# Altium schematic sheet Schematic.SchDoc (part 1 of 2)
size D; SheetNumber: 1; SheetTotal: 2
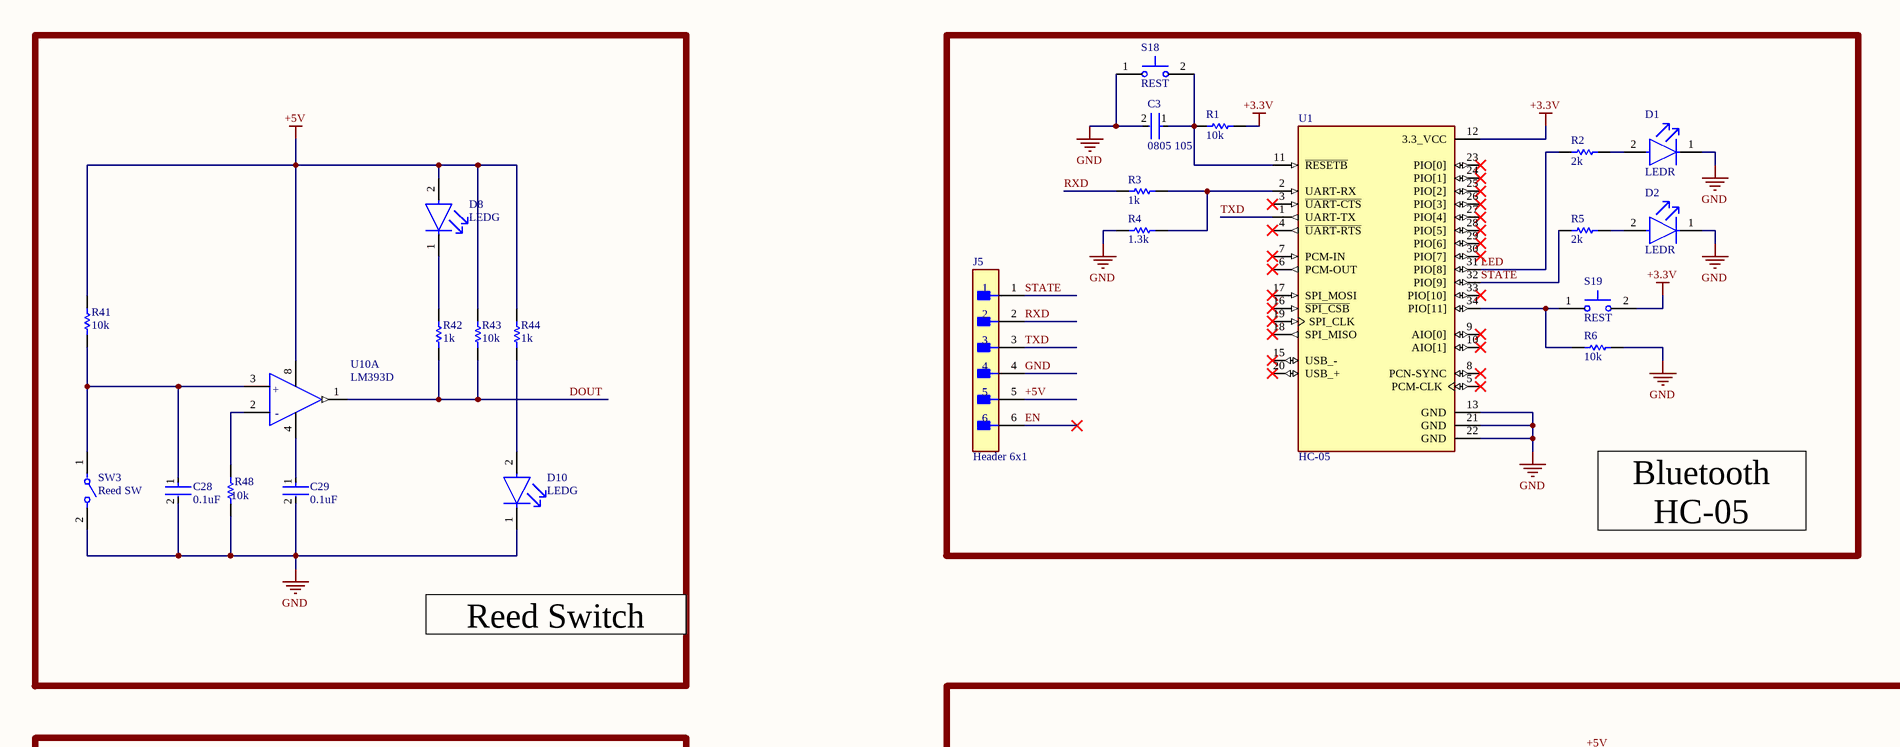
[diagram p0: Schematic.SchDoc, top left]
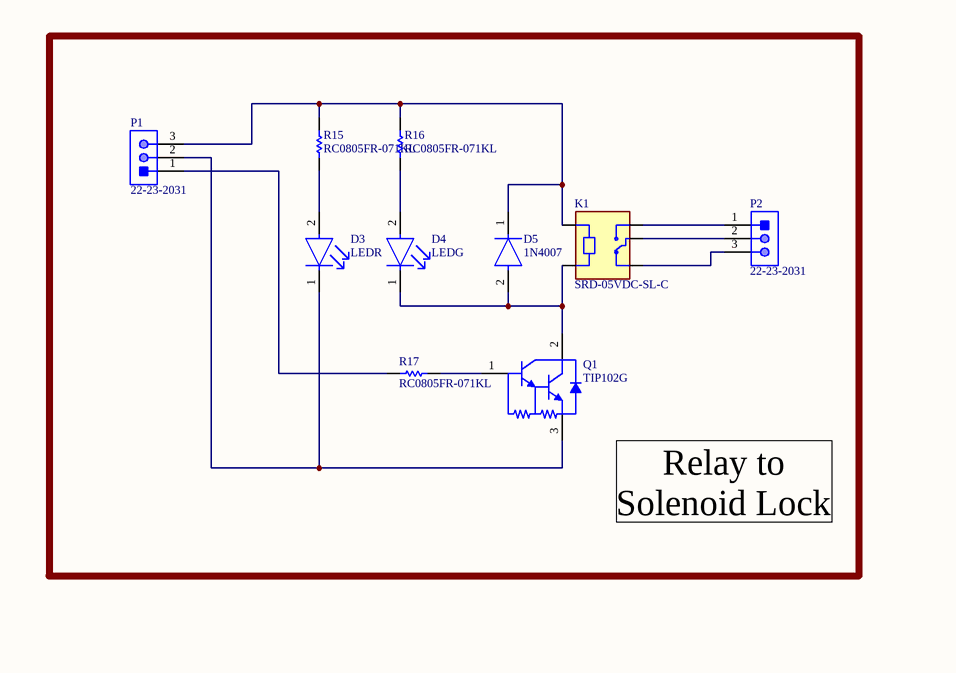
[diagram p1: Schematic.SchDoc, top right]
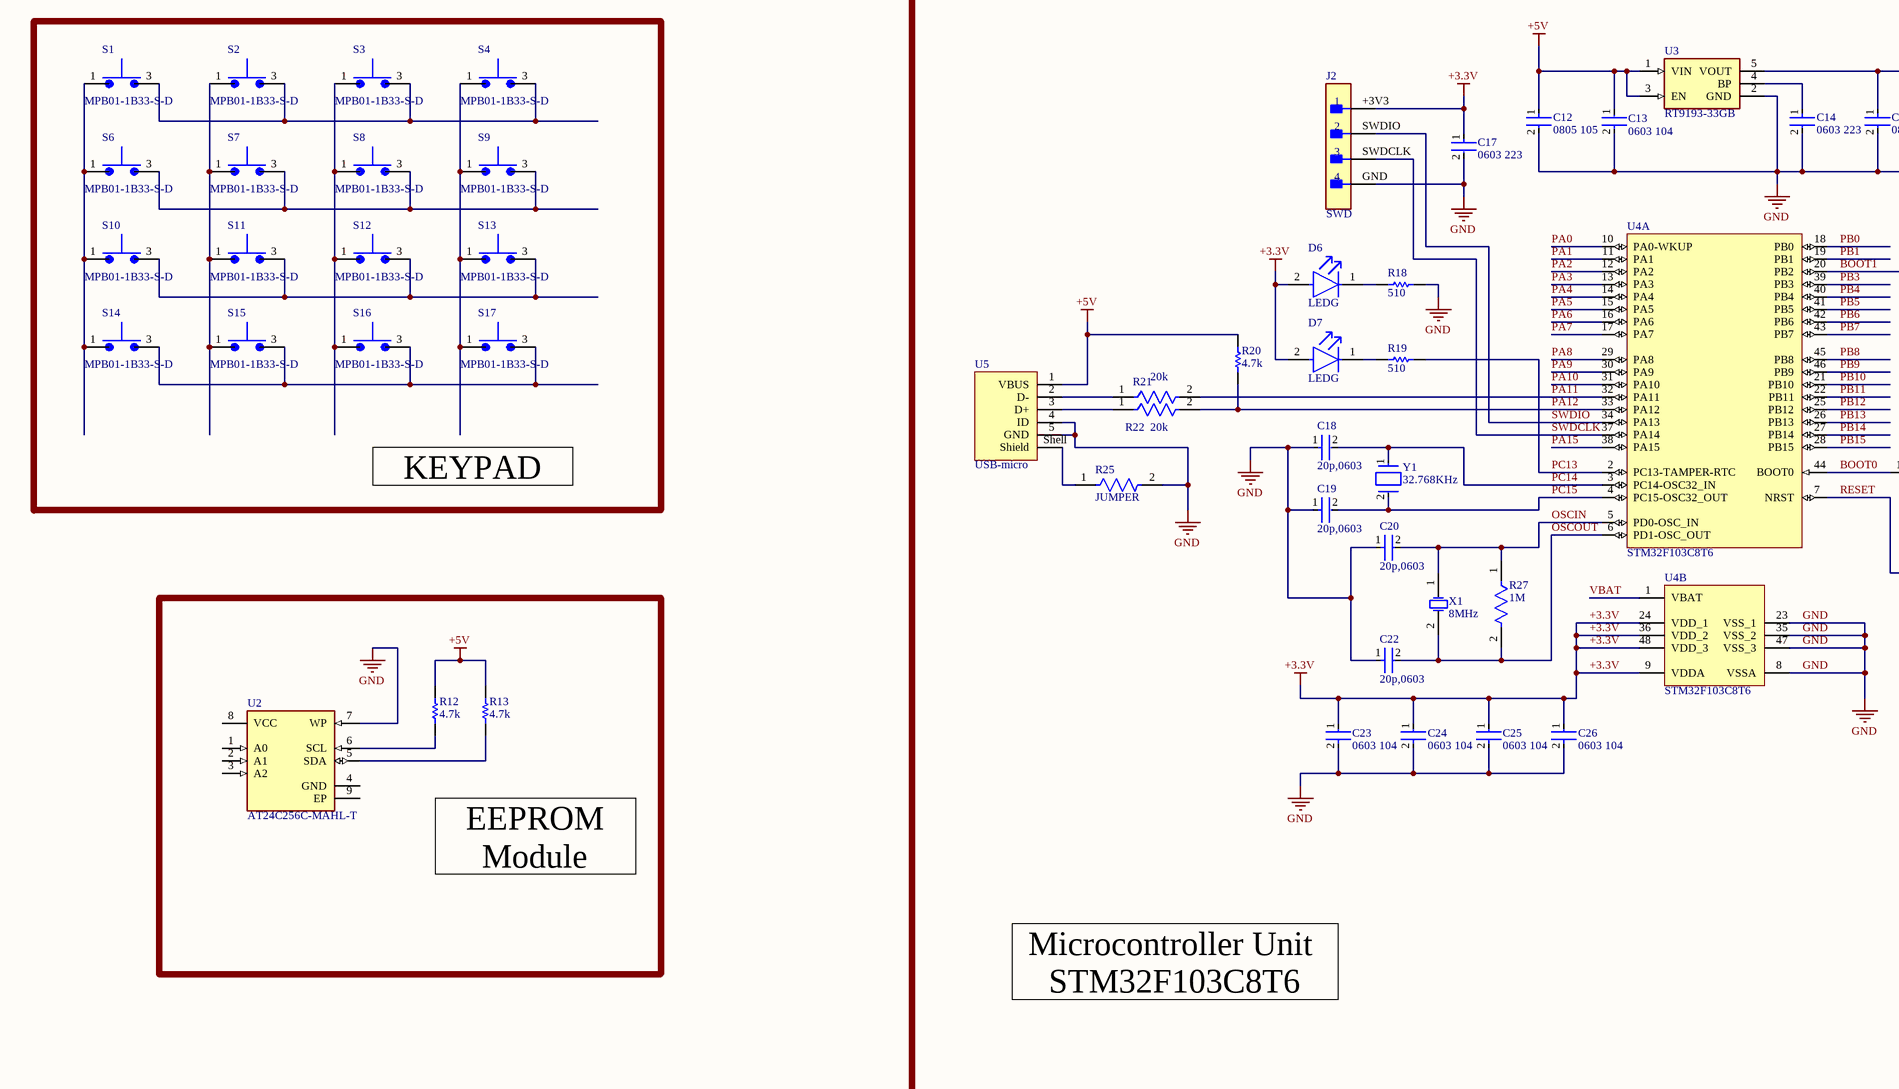
[diagram p2: Schematic.SchDoc, bottom left]
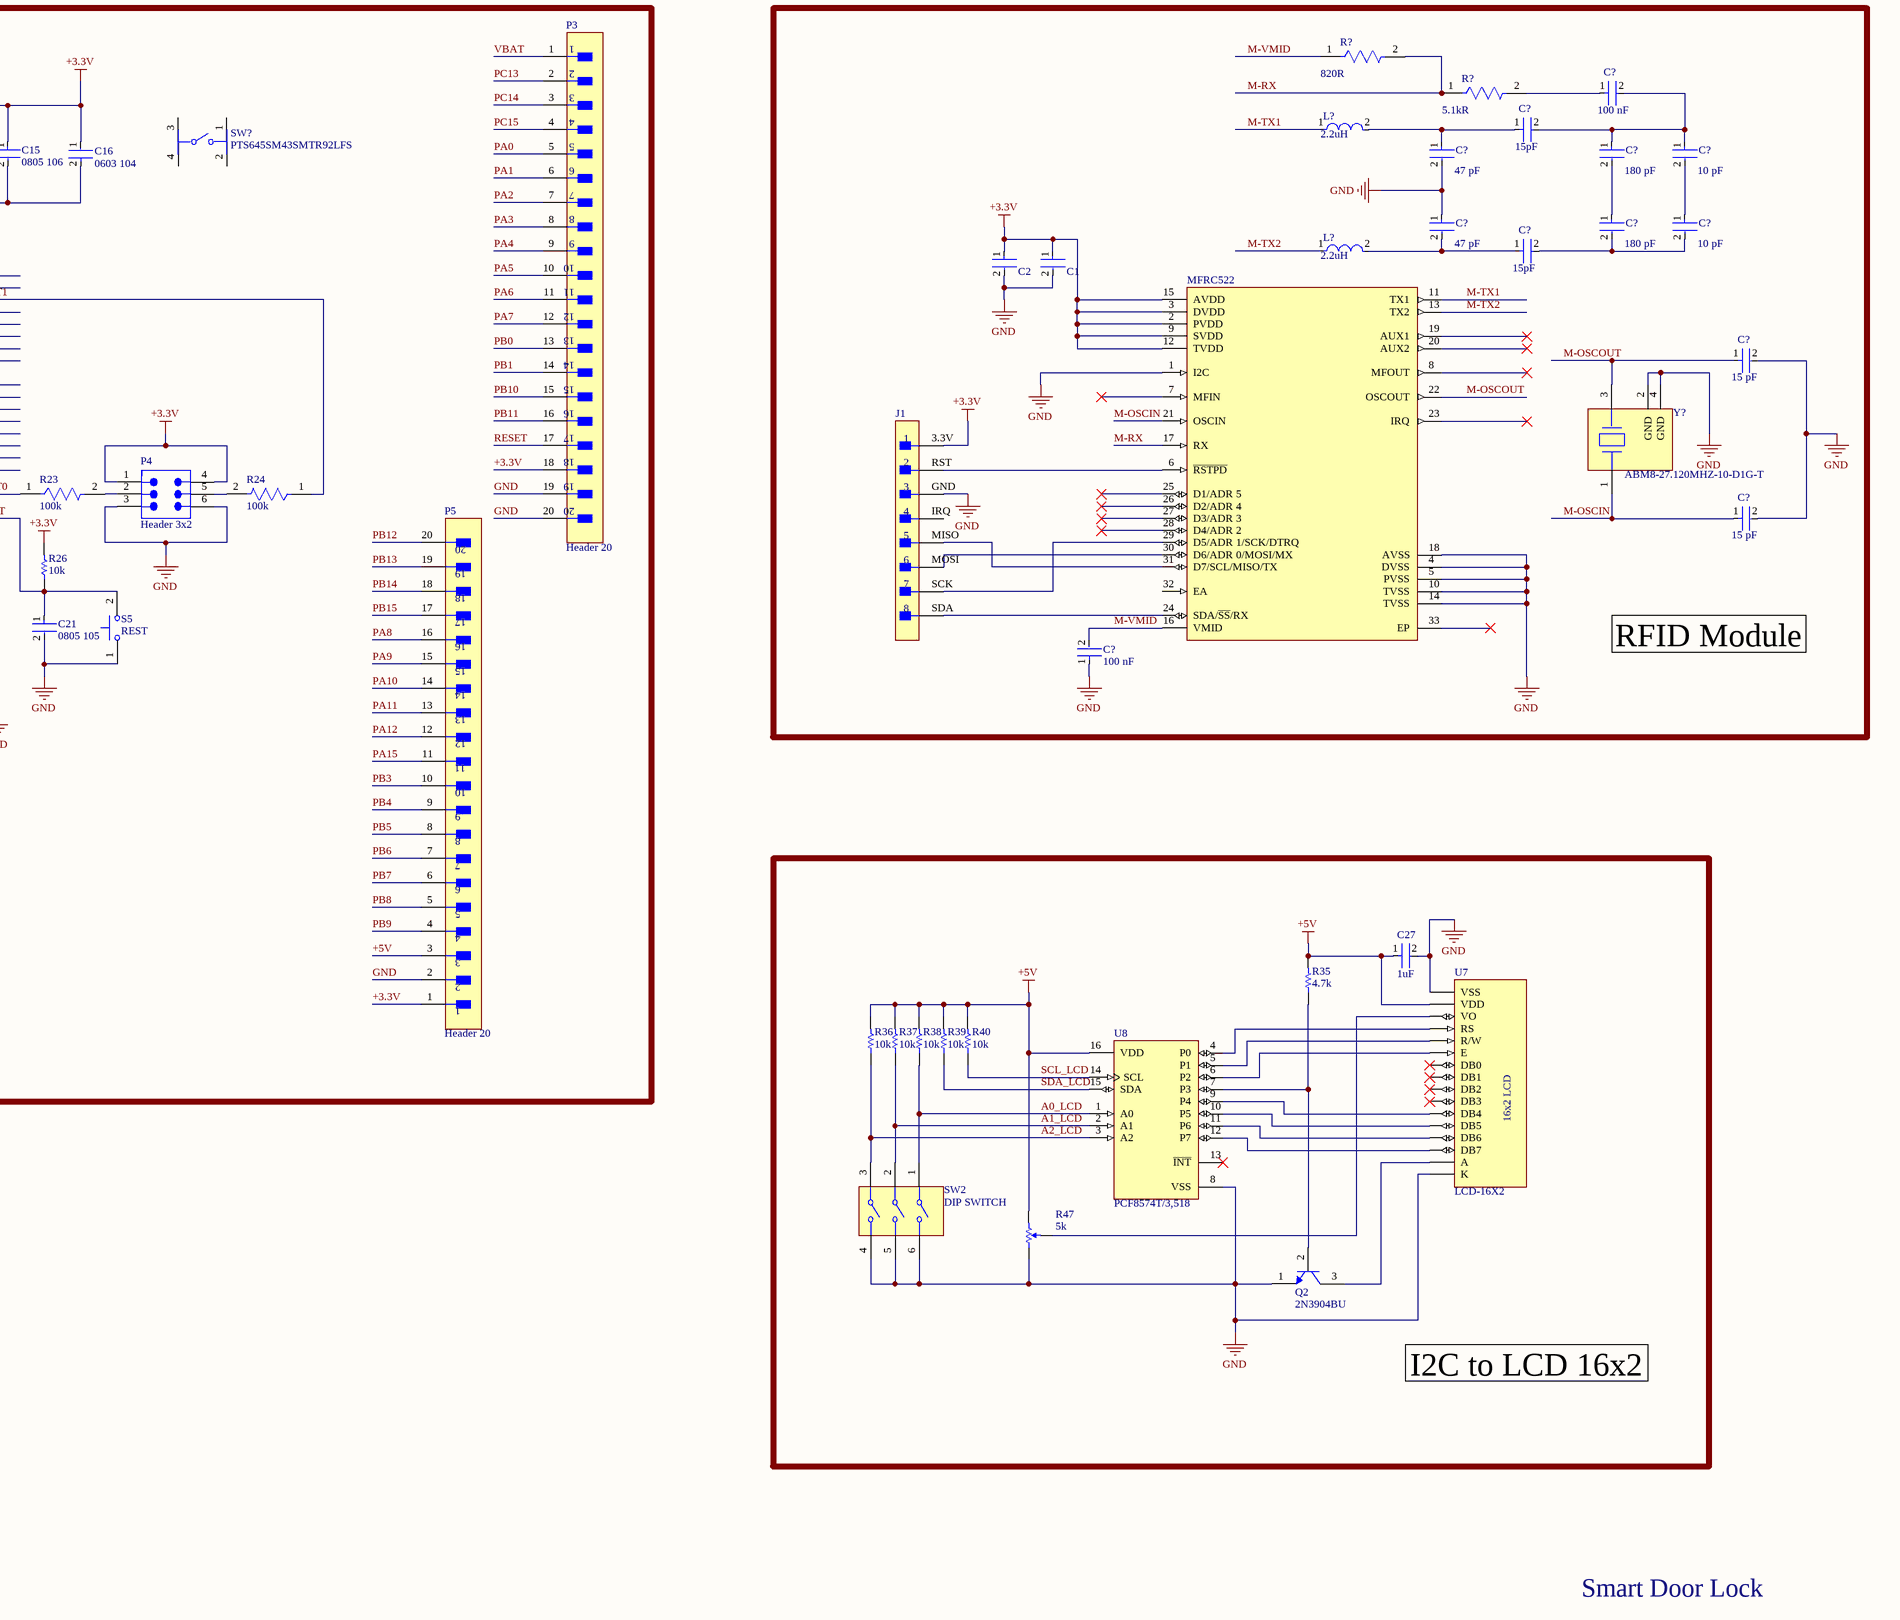
[diagram p3: Schematic.SchDoc, bottom right]

## Parts
(Parts that share a designator on the sheet are numbered #1, #2 ... from top to bottom, then left to right.)
C1  CC0805KKX7R8BB105  [FP-CC0805-0_85-MFG]  (value not drawn)
C2  CC0805KKX7R8BB105  [FP-CC0805-0_85-MFG]  (value not drawn)
C3  0805 105  [FP-CC0805-0_85-MFG]
C12  0805 105  [FP-CC0805-0_85-MFG]
C13  0603 104  [FP-C1608-080-0_1-IPC_C]
C14  0603 223  [FP-CC0603-DA-MFG]
C15  0805 106  [FP-0805-L_2_01_0_2-W_1_25-MFG]
C16  0603 104  [FP-C1608-080-0_1-IPC_C]
C17  0603 223  [FP-CC0603-DA-MFG]
C18  20p,0603  [FP-C0603C-CF-MFG]
C19  20p,0603  [FP-C0603C-CF-MFG]
C20  20p,0603  [FP-C0603C-CF-MFG]
C21  0805 105  [FP-CC0805-0_85-MFG]
C22  20p,0603  [FP-C0603C-CF-MFG]
C23  0603 104  [FP-C1608-080-0_1-IPC_C]
C24  0603 104  [FP-C1608-080-0_1-IPC_C]
C25  0603 104  [FP-C1608-080-0_1-IPC_C]
C26  0603 104  [FP-C1608-080-0_1-IPC_C]
C27  1uF  [FP-CC0805-0_85-MFG]
C28  0.1uF  [FP-C0402-BB-MFG]
C29  0.1uF  [FP-C0402-BB-MFG]
C?#1  value 100 nF  [FP-CC0201-BA-MFG]  (hidden comment: CC0201MRX5R5BB104)
C?#2  Capacitance: 15pF  [FP-CC0603-0_9-MFG]  (hidden comment: CC0603JRNPO9BN150)
C?#3  Capacitance: 47 pF  [FP-C0805C-DN-MFG]  (hidden comment: C0805C470J5GACTU)
C?#4  value 180 pF  [FP-C0805C-DN-MFG]  (hidden comment: C0805C181J5GACTU)
C?#5  Capacitance: 10 pF  [FP-C0402-BB-MFG]  (hidden comment: C0402C100J5GACTU)
C?#6  Capacitance: 47 pF  [FP-C0805C-DN-MFG]  (hidden comment: C0805C470J5GACTU)
C?#7  value 180 pF  [FP-C0805C-DN-MFG]  (hidden comment: C0805C181J5GACTU)
C?#8  Capacitance: 10 pF  [FP-C0402-BB-MFG]  (hidden comment: C0402C100J5GACTU)
C?#9  Capacitance: 15pF  [FP-CC0603-0_9-MFG]  (hidden comment: CC0603JRNPO9BN150)
C?#10  value 15 pF  [FP-C1206C-EB-MFG]  (hidden comment: C1206C150J5GACTU)
C?#11  value 15 pF  [FP-C1206C-EB-MFG]  (hidden comment: C1206C150J5GACTU)
C?#12  value 100 nF  [FP-CC0201-BA-MFG]  (hidden comment: CC0201MRX5R5BB104)
D1  LEDR  [FP-LTST-C191KRKT-MFG]
D2  LEDR  [FP-LTST-C191KRKT-MFG]
D3  LEDR  [FP-LTST-C191KRKT-MFG]
D4  LEDG  [FP-LTST-C190GKT-MFG]
D5  1N4007  [FP-1N4007-MFG]
D6  LEDG  [FP-LTST-C190GKT-MFG]
D7  LEDG  [FP-LTST-C190GKT-MFG]
D8  LEDG  [FP-LTST-C190GKT-MFG]
D10  LEDG  [FP-LTST-C190GKT-MFG]
J1  53047-0810  [53047-0810_MFG]  (value not drawn)
J2  SWD  [FP-M20-9990445-MFG]
J5  Header 6x1  [FP-26-61-4060-MFG]
K1  SRD-05VDC-SL-C  [RELAY_SRD-05VDC-SL-C]
L?#1  Inductance: 2.2uH  [FP-IHLP-2525BD-FP_2_413x3-MFG]  (hidden comment: IHLP2525BDER2R2M01)
L?#2  Inductance: 2.2uH  [FP-IHLP-2525BD-FP_2_413x3-MFG]  (hidden comment: IHLP2525BDER2R2M01)
MFRC522  MFRC52202HN1,151  [FP-SOT617-1-MFG]  (value not drawn)
P1  22-23-2031  [MOLX-22-23-2031_V]
P2  22-23-2031  [MOLX-22-23-2031_V]
P3  Header 20  [FP-90325-0020-MFG]
P4  Header 3x2  [649006227222]
P5  Header 20  [FP-90325-0020-MFG]
Q1  TIP102G  [ONSC-TO-220-3-221A-09]
Q2  2N3904BU  [FAIR-TO-92]
R1  10k  [RESC2013X60X35NL10T20]
R2  2k  [RESC1609X50X30ML10T20]
R3  1k  [RESC2013X60X35ML10T20]
R4  1.3k  [RESC1609X50X30NL10T20]
R5  2k  [RESC1609X50X30ML10T20]
R6  10k  [RESC2013X60X35NL10T20]
R12  4.7k  [RESC1608X55X25LL10T15]
R13  4.7k  [RESC1608X55X25LL10T15]
R15  RC0805FR-071KL  [RESC2013X60X35ML10T20]
R16  RC0805FR-071KL  [RESC2013X60X35ML10T20]
R17  RC0805FR-071KL  [RESC2013X60X35ML10T20]
R18  510  [RESC1609X50X30NL10T20]
R19  510  [RESC1609X50X30NL10T20]
R20  4.7k  [RESC1608X55X25LL10T15]
R21  20k  [FP-RG1005-MFG]
R22  20k  [FP-RG1005-MFG]
R23  100k  [FP-AC0603-MFG]
R24  100k  [FP-AC0603-MFG]
R25  JUMPER  [FP-ERJ-3GEY0R00V-MFG]
R26  10k  [RESC2013X60X35NL10T20]
R27  1M  [FP-ERJ3EK-IPC_C]
R35  4.7k  [RESC1608X55X25LL10T15]
R36  10k  [RESC1608X55X25ML10T15]
R37  10k  [RESC1608X55X25ML10T15]
R38  10k  [RESC1608X55X25ML10T15]
R39  10k  [RESC1608X55X25ML10T15]
R40  10k  [RESC1608X55X25ML10T15]
R41  10k  [RESC1608X55X25ML10T15]
R42  1k  [RESC2013X60X35ML10T20]
R43  10k  [RESC1608X55X25ML10T15]
R44  1k  [RESC2013X60X35ML10T20]
R47  5k  [BOUR-3214W_V]
R48  10k  [RESC1608X55X25ML10T15]
R?#1  Resistance: 820R  [FP-CRCW0805-e3-IPC_B]  (hidden comment: CRCW0805820RFKEA)
R?#2  Resistance: 5.1kR  [FP-ERJ2RK-IPC_A]  (hidden comment: ERJ-2RKF5101X)
S1  MPB01-1B33-S-D  [SW_MPB01-1B33-S-D]
S2  MPB01-1B33-S-D  [SW_MPB01-1B33-S-D]
S3  MPB01-1B33-S-D  [SW_MPB01-1B33-S-D]
S4  MPB01-1B33-S-D  [SW_MPB01-1B33-S-D]
S5  REST  [SW_BUTT-2]
S6  MPB01-1B33-S-D  [SW_MPB01-1B33-S-D]
S7  MPB01-1B33-S-D  [SW_MPB01-1B33-S-D]
S8  MPB01-1B33-S-D  [SW_MPB01-1B33-S-D]
S9  MPB01-1B33-S-D  [SW_MPB01-1B33-S-D]
S10  MPB01-1B33-S-D  [SW_MPB01-1B33-S-D]
S11  MPB01-1B33-S-D  [SW_MPB01-1B33-S-D]
S12  MPB01-1B33-S-D  [SW_MPB01-1B33-S-D]
S13  MPB01-1B33-S-D  [SW_MPB01-1B33-S-D]
S14  MPB01-1B33-S-D  [SW_MPB01-1B33-S-D]
S15  MPB01-1B33-S-D  [SW_MPB01-1B33-S-D]
S16  MPB01-1B33-S-D  [SW_MPB01-1B33-S-D]
S17  MPB01-1B33-S-D  [SW_MPB01-1B33-S-D]
S18  REST  [SW_BUTT-2]
S19  REST  [SW_BUTT-2]
SW2  DIP SWITCH  [FP-A6S-3102-H-MFG]
SW3  Reed SW  [FP-MDSR-7-MFG]
SW?  PTS645SM43SMTR92LFS  [FP-PTS645SM43SMTR92LFS-MFG]
U1  HC-05  [XCVR_HC-05]
U2  AT24C256C-MAHL-T  [FP-C04-21355-Q4B-MFG]
U3  RT9193-33GB  [SOT94P279X129-5N]
U4  STM32F103C8T6  [STM-LQFP48_L]  (parts A,B of 2)
U5  USB-micro  [629105136821]
U7  LCD-16X2  [MODULE_LCD-16X2]
U8  PCF8574T/3,518  [FP-SOT162-1-MFG]
U10  LM393D  [FP-SO8-MFG]  (part A of 2)
X1  8MHz  [ECS-80-18-5PX-TR_V]
Y1  32.768KHz  [FP-ABS05W-MFG]
Y?  ABM8-27.120MHZ-10-D1G-T  [FP-ABM8-MFG]

## Nets
+3.3V: C1.1 C2.1 C15.1 C16.1 C17.1 C23.1 C24.1 C25.1 C26.1 D6.2(A) D7.2(A) J1.3.3V J2.+3V3 MFRC522.2(PVDD) MFRC522.3(DVDD) MFRC522.9(SVDD) MFRC522.12(TVDD) MFRC522.15(AVDD) P3.18 P4.1 P4.4 P5.1 R1.2 R26.2 S19.2 U1.12(3.3_VCC) U3.5(VOUT) U4.9(VDDA) U4.24(VDD_1) U4.36(VDD_2) U4.48(VDD_3)
+5V: C12.1 C13.1 C27.1 D8.2(A) J5.5 P5.3 R12.2 R13.2 R20.2 R35.2 R36.2 R37.2 R38.2 R39.2 R40.2 R41.2 R43.2 R44.2 R47.3 U3.1(VIN) U3.3(EN) U5.1(VBUS) U7.2(VDD) U8.16(VDD) U10.8(Vcc+)
GND: C1.2 C2.2 C3.2 C12.2 C13.2 C14.2 C15.2 C16.2 C17.2 C18.1 C19.1 C20.1 C21.2 C22.1 C23.2 C24.2 C25.2 C26.2 C27.2 C28.2 C29.2 C?#3.2 C?#6.1 C?#10.2 C?#11.2 C?#12.1 D1.1(C) D2.1(C) D10.1(C) J1.GND J2.GND J5.4 MFRC522.1(I2C) MFRC522.4(DVSS) MFRC522.5(PVSS) MFRC522.10(TVSS) MFRC522.14(TVSS) MFRC522.18(AVSS) P3.19 P3.20 P4.3 P4.6 P5.2 Q2.1(E) R4.1 R6.2 R18.2 R25.2 R47.1 R48.1 S5.1 S18.1 SW2.4 SW2.5 SW2.6 SW3.2 U1.13(GND) U1.21(GND) U1.22(GND) U2.7(WP) U3.2(GND) U4.8(VSSA) U4.23(VSS_1) U4.35(VSS_2) U4.47(VSS_3) U5.4(ID) U5.5(GND) U7.1(VSS) U7.16(K) U8.8(VSS) Y?.2(GND) Y?.4(GND)
A0_LCD: R38.1 SW2.1 U8.1(A0)
A1_LCD: R37.1 SW2.2 U8.2(A1)
A2_LCD: R36.1 SW2.3 U8.3(A2)
BOOT0: R23.1 U4.44(BOOT0)
BOOT1: R24.1 U4.20(PB2)
DOUT: R42.1 R43.1 U10.1(Out1)
EN: J5.6
LED: R2.1 U1.31(PIO[8])
M-OSCIN: C?#11.1 MFRC522.21(OSCIN) Y?.1
M-OSCOUT: C?#10.1 MFRC522.22(OSCOUT) Y?.3
M-RX: MFRC522.17(RX) R?#1.2 R?#2.1
M-TX1: L?#1.1 MFRC522.11(TX1)
M-TX2: L?#2.1 MFRC522.13(TX2)
M-VMID: C?#12.2 MFRC522.16(VMID) R?#1.1
OSCIN: C20.2 R27.1 U4.5(PD0-OSC_IN) X1.1(X1)
OSCOUT: C22.2 R27.2 U4.6(PD1-OSC_OUT) X1.2(X2)
PA0: P3.5 U4.10(PA0-WKUP)
PA1: P3.6 U4.11(PA1)
PA2: P3.7 U4.12(PA2)
PA3: P3.8 U4.13(PA3)
PA4: P3.9 U4.14(PA4)
PA5: P3.10 U4.15(PA5)
PA6: P3.11 U4.16(PA6)
PA7: P3.12 U4.17(PA7)
PA8: P5.16 U4.29(PA8)
PA9: P5.15 U4.30(PA9)
PA10: P5.14 U4.31(PA10)
PA11: P5.13 R21.2 U4.32(PA11)
PA12: P5.12 R20.1 R22.2 U4.33(PA12)
PA15: P5.11 U4.38(PA15)
PB0: P3.13 U4.18(PB0)
PB1: P3.14 U4.19(PB1)
PB3: P5.10 U4.39(PB3)
PB4: P5.9 U4.40(PB4)
PB5: P5.8 U4.41(PB5)
PB6: P5.7 U4.42(PB6)
PB7: P5.6 U4.43(PB7)
PB8: P5.5 U4.45(PB8)
PB9: P5.4 U4.46(PB9)
PB10: P3.15 U4.21(PB10)
PB11: P3.16 U4.22(PB11)
PB12: P5.20 U4.25(PB12)
PB13: P5.19 U4.26(PB13)
PB14: P5.18 U4.27(PB14)
PB15: P5.17 U4.28(PB15)
PC13: P3.2 R19.2 U4.2(PC13-TAMPER-RTC)
PC14: C18.2 P3.3 U4.3(PC14-OSC32_IN) Y1.1
PC15: C19.2 P3.4 U4.4(PC15-OSC32_OUT) Y1.2
RESET: C21.1 P3.17 R26.1 S5.2 U4.7(NRST)
RXD: J5.2 R3.1
SCL_LCD: R40.1 U8.14(SCL)
SDA_LCD: R39.1 U8.15(SDA)
STATE: J5.1 R5.1 U1.32(PIO[9])
SWDCLK: J2.SWDCLK U4.37(PA14)
SWDIO: J2.SWDIO U4.34(PA13)
TXD: J5.3 U1.1(UART-TX)
VBAT: P3.1 U4.1(VBAT)
NetC3_1: C3.1 R1.1 S18.2 U1.11(~{RESETB})
NetC14_1: C14.1 U3.4(BP)
NetC28_1: C28.1 R41.1 SW3.1 U10.3(In1+)
NetC29_1: C29.1 U10.4(Vcc-)
NetC?#1_1: C?#1.1 R?#2.2
NetC?#1_2: C?#1.2 C?#2.2 C?#4.1 C?#5.1
NetC?#2_1: C?#2.1 C?#3.1 L?#1.2
NetC?#4_2: C?#4.2 C?#7.1
NetC?#5_2: C?#5.2 C?#8.1
NetC?#6_2: C?#6.2 C?#9.1 L?#2.2
NetC?#7_2: C?#7.2 C?#8.2 C?#9.2
NetD1_2: D1.2(A) R2.2
NetD2_2: D2.2(A) R5.2
NetD3_1: D3.1(C) P1.2 Q1.3(E)
NetD3_2: D3.2(A) R15.1
NetD4_1: D4.1(C) D5.2(A) K1.A2 Q1.2(C)
NetD4_2: D4.2(A) R16.1
NetD5_1: D5.1(C) K1.A1 P1.3 R15.2 R16.2
NetD6_1: D6.1(C) R18.1
NetD7_1: D7.1(C) R19.1
NetD8_1: D8.1(C) R42.2
NetD10_2: D10.2(A) R44.1
NetJ1_MISO: J1.MISO MFRC522.31(D7/SCL/MISO/TX)
NetJ1_MOSI: J1.MOSI MFRC522.30(D6/ADR_0/MOSI/MX)
NetJ1_RST: J1.RST MFRC522.6(~{RSTPD})
NetJ1_SCK: J1.SCK MFRC522.29(D5/ADR_1/SCK/DTRQ)
NetJ1_SDA: J1.SDA MFRC522.24(SDA/~{SS}/RX)
NetK1_COM: K1.COM P2.2
NetK1_NC: K1.NC P2.3
NetK1_NO: K1.NO P2.1
NetP1_1: P1.1 R17.1
NetP4_2: P4.2 R23.2
NetP4_5: P4.5 R24.2
NetQ1_1: Q1.1(B) R17.2
NetQ2_2: Q2.2(B) R35.1 U8.7(P3)
NetQ2_3: Q2.3(C) U7.15(A)
NetR3_2: R3.2 R4.2 U1.2(UART-RX)
NetR6_1: R6.1 S19.1 U1.34(PIO[11])
NetR12_1: R12.1 U2.6(SCL)
NetR13_1: R13.1 U2.5(SDA)
NetR21_1: R21.1 U5.2(D-)
NetR22_1: R22.1 U5.3(D+)
NetR25_1: R25.1 U5.Shell(Shield)
NetR47_2: R47.2 U7.3(VO)
NetR48_2: R48.2 U10.2(In1-)
NetS1_1: S1.1 S6.1 S10.1 S14.1
NetS1_3: S1.3 S2.3 S3.3 S4.3
NetS2_1: S2.1 S7.1 S11.1 S15.1
NetS3_1: S3.1 S8.1 S12.1 S16.1
NetS4_1: S4.1 S9.1 S13.1 S17.1
NetS6_3: S6.3 S7.3 S8.3 S9.3
NetS10_3: S10.3 S11.3 S12.3 S13.3
NetS14_3: S14.3 S15.3 S16.3 S17.3
NetU7_4: U7.4(RS) U8.4(P0)
NetU7_5: U7.5(R/W) U8.5(P1)
NetU7_6: U7.6(E) U8.6(P2)
NetU7_11: U7.11(DB4) U8.9(P4)
NetU7_12: U7.12(DB5) U8.10(P5)
NetU7_13: U7.13(DB6) U8.11(P6)
NetU7_14: U7.14(DB7) U8.12(P7)

Not connected (* = marked no-connect by the designer): J1 IRQ(4); MFRC522 7(MFIN)* 8(MFOUT)* 19(AUX1)* 20(AUX2)* 23(IRQ)* 25(D1/ADR_5)* 26(D2/ADR_4)* 27(D3/ADR_3)* 28(D4/ADR_2)* 32(EA) 33(EP)*; SW? 1 2 3 4; U1 3(~{UART-CTS})* 4(~{UART-RTS})* 5(PCM-CLK)* 6(PCM-OUT)* 7(PCM-IN)* 8(PCN-SYNC)* 9(AIO[0])* 10(AIO[1])* 15(USB_-)* 16(~{SPI_CSB})* 17(SPI_MOSI)* 18(SPI_MISO)* 19(SPI_CLK)* 20(USB_+)* 23(PIO[0])* 24(PIO[1])* 25(PIO[2])* 26(PIO[3])* 27(PIO[4])* 28(PIO[5])* 29(PIO[6])* 30(PIO[7])* 33(PIO[10])*; U2 1(A0) 2(A1) 3(A2) 4(GND) 8(VCC) 9(EP); U7 7(DB0)* 8(DB1)* 9(DB2)* 10(DB3)*; U8 13(~{INT})*

## Notes on the sheet
- Relay to Solenoid Lock
- Bluetooth
  HC-05 Module
- Reed Switch
- KEYPAD
- RFID Module
- EEPROM Module
- Microcontroller Unit
  STM32F103C8T6
- I2C to LCD 16x2
- Smart Door Lock
- (in symbol CMP-00030-00001-1) 16x2 LCD
- (in symbol CMP-12132-000003-1, part A) +; -